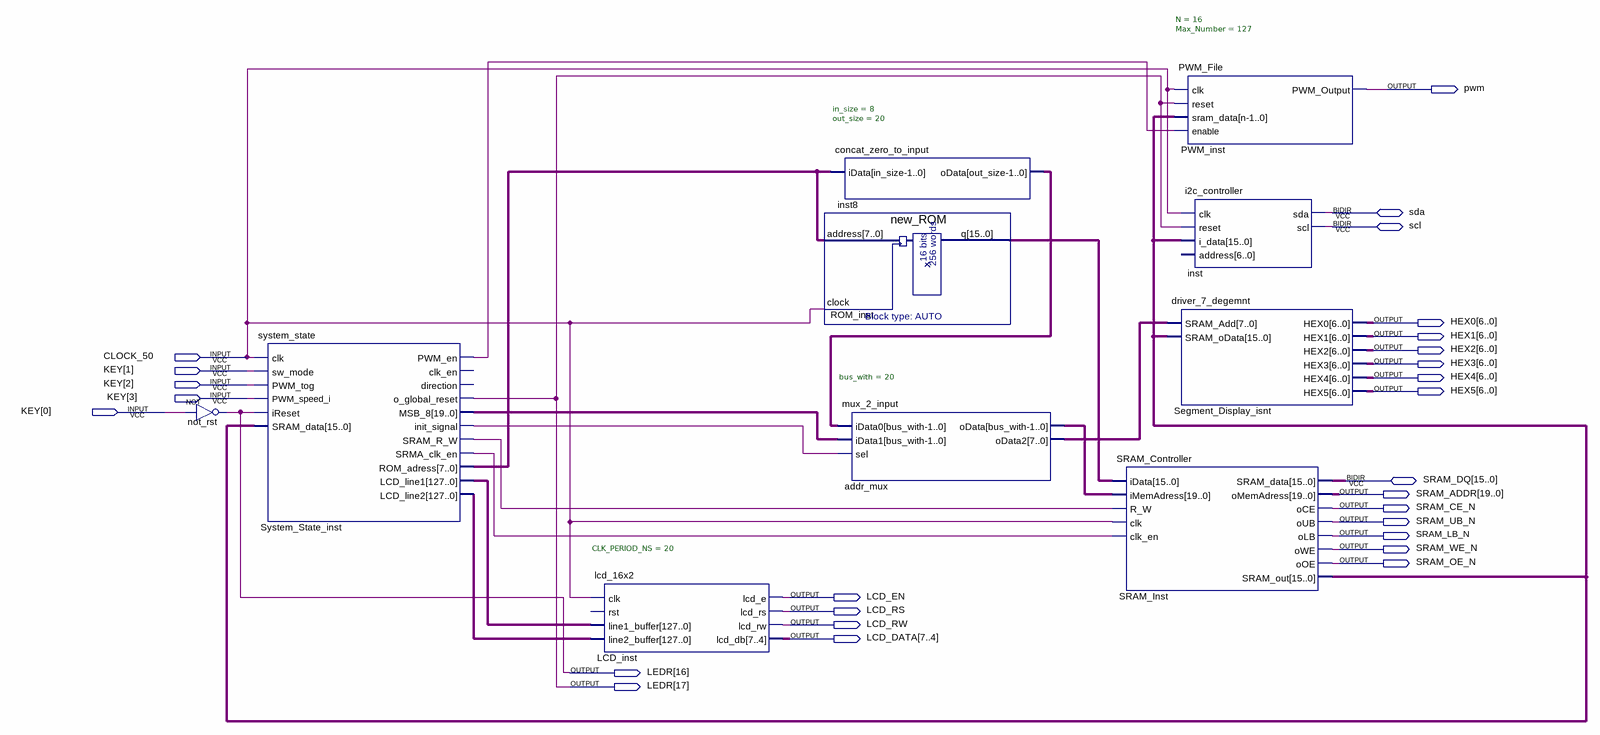
[diagram p0: schematic sheet]
// Quartus schematic EE316_project_2.bdf as structural Verilog: 10 symbols, 27 pins
module EE316_project_2 (
  input  CLOCK_50,
  input  [3:0] KEY,
  inout  sda,
  inout  scl,
  inout  [15:0] SRAM_DQ,
  output pwm,
  output [6:0] HEX0,
  output [6:0] HEX1,
  output [6:0] HEX2,
  output [6:0] HEX3,
  output [6:0] HEX4,
  output [6:0] HEX5,
  output [19:0] SRAM_ADDR,
  output SRAM_CE_N,
  output SRAM_UB_N,
  output SRAM_LB_N,
  output SRAM_WE_N,
  output SRAM_OE_N,
  output LCD_EN,
  output LCD_RS,
  output LCD_RW,
  output [7:4] LCD_DATA,
  output [17:16] LEDR
);

  wire System_State_inst_init_signal, System_State_inst_pwm_en, System_State_inst_sram_r_w,
       System_State_inst_srma_clk_en;
  wire [7:0] addr_mux_odata2, System_State_inst_rom_adress;
  wire [15:0] ROM_inst_q, SRAM_Inst_sram_out;
  wire [19:0] addr_mux_odata, inst8_odata, System_State_inst_msb_8;
  wire [127:0] System_State_inst_lcd_line1, System_State_inst_lcd_line2;

  not not_rst (LEDR[16], KEY[0]);
  system_state System_State_inst (
    .clk(CLOCK_50), .sw_mode(KEY[1]), .PWM_tog(KEY[2]), .PWM_speed_i(KEY[3]), .iReset(LEDR[16]),
    .SRAM_data(SRAM_Inst_sram_out), .PWM_en(System_State_inst_pwm_en), .o_global_reset(LEDR[17]),
    .MSB_8(System_State_inst_msb_8), .init_signal(System_State_inst_init_signal),
    .SRAM_R_W(System_State_inst_sram_r_w), .SRMA_clk_en(System_State_inst_srma_clk_en),
    .ROM_adress(System_State_inst_rom_adress), .LCD_line1(System_State_inst_lcd_line1),
    .LCD_line2(System_State_inst_lcd_line2));  // open: clk_en, direction
  lcd_16x2 #(.CLK_PERIOD_NS(20)) LCD_inst (
    .clk(CLOCK_50), .line1_buffer(System_State_inst_lcd_line1), .line2_buffer(System_State_inst_lcd_line2),
    .lcd_e(LCD_EN), .lcd_rs(LCD_RS), .lcd_rw(LCD_RW), .lcd_db(LCD_DATA));  // open: rst
  concat_zero_to_input #(.in_size(8), .out_size(20)) inst8 (.iData(System_State_inst_rom_adress), .oData(inst8_odata));
  new_ROM ROM_inst (.address(System_State_inst_rom_adress), .clock(CLOCK_50), .q(ROM_inst_q));
  mux_2_input #(.bus_with(20)) addr_mux (
    .iData0(inst8_odata), .iData1(System_State_inst_msb_8), .sel(System_State_inst_init_signal),
    .oData(addr_mux_odata), .oData2(addr_mux_odata2));
  SRAM_Controller SRAM_Inst (
    .iData(ROM_inst_q), .iMemAdress(addr_mux_odata), .R_W(System_State_inst_sram_r_w), .clk(CLOCK_50),
    .clk_en(System_State_inst_srma_clk_en), .oMemAdress(SRAM_ADDR), .oCE(SRAM_CE_N), .oUB(SRAM_UB_N),
    .oLB(SRAM_LB_N), .oWE(SRAM_WE_N), .oOE(SRAM_OE_N), .SRAM_out(SRAM_Inst_sram_out), .SRAM_data(SRAM_DQ));
  PWM_File #(.N(16), .Max_Number(127)) PWM_inst (
    .clk(CLOCK_50), .reset(LEDR[17]), .sram_data(SRAM_Inst_sram_out), .enable(System_State_inst_pwm_en),
    .PWM_Output(pwm));
  i2c_controller inst (
    .clk(CLOCK_50), .reset(LEDR[17]), .i_data(SRAM_Inst_sram_out), .sda(sda), .scl(scl));  // open: address
  driver_7_degemnt Segment_Display_isnt (
    .SRAM_Add(addr_mux_odata2), .SRAM_oData(SRAM_Inst_sram_out), .HEX0(HEX0), .HEX1(HEX1), .HEX2(HEX2),
    .HEX3(HEX3), .HEX4(HEX4), .HEX5(HEX5));
endmodule
